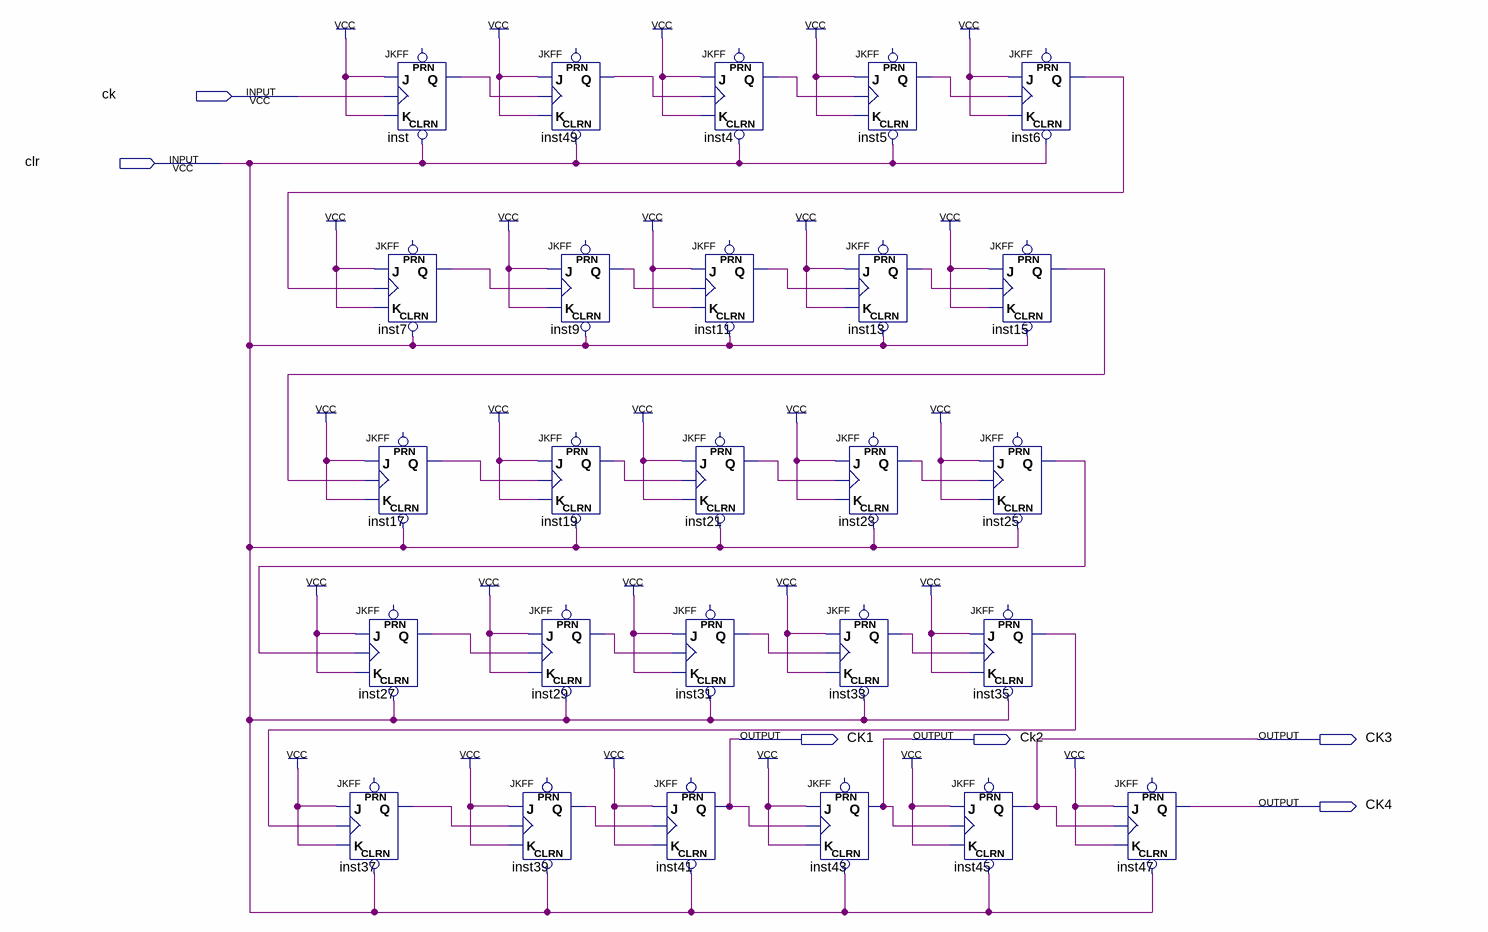
[diagram p0: schematic sheet]
// Quartus schematic ck1.bdf as structural Verilog: 26 symbols, 6 pins
module ck1 (
  input  ck,
  input  clr,
  output CK1,
  output Ck2,
  output CK3,
  output CK4
);

  wire inst4_q, inst5_q, inst6_q, inst7_q, inst9_q, inst11_q, inst13_q, inst15_q, inst17_q, inst19_q,
       inst21_q, inst23_q, inst25_q, inst27_q, inst29_q, inst31_q, inst33_q, inst35_q, inst37_q, inst39_q,
       inst49_q, inst_q;

  JKFF inst17 (.CLRN(clr), .K(1'b1), .J(1'b1), .CLK(inst15_q), .Q(inst17_q));  // open: PRN
  JKFF inst27 (.CLRN(clr), .K(1'b1), .J(1'b1), .CLK(inst25_q), .Q(inst27_q));  // open: PRN
  JKFF inst37 (.CLRN(clr), .K(1'b1), .J(1'b1), .CLK(inst35_q), .Q(inst37_q));  // open: PRN
  JKFF inst (.CLRN(clr), .K(1'b1), .J(1'b1), .CLK(ck), .Q(inst_q));  // open: PRN
  JKFF inst7 (.CLRN(clr), .K(1'b1), .J(1'b1), .CLK(inst6_q), .Q(inst7_q));  // open: PRN
  JKFF inst39 (.CLRN(clr), .K(1'b1), .J(1'b1), .CLK(inst37_q), .Q(inst39_q));  // open: PRN
  JKFF inst49 (.CLRN(clr), .K(1'b1), .J(1'b1), .CLK(inst_q), .Q(inst49_q));  // open: PRN
  JKFF inst9 (.CLRN(clr), .K(1'b1), .J(1'b1), .CLK(inst7_q), .Q(inst9_q));  // open: PRN
  JKFF inst19 (.CLRN(clr), .K(1'b1), .J(1'b1), .CLK(inst17_q), .Q(inst19_q));  // open: PRN
  JKFF inst29 (.CLRN(clr), .K(1'b1), .J(1'b1), .CLK(inst27_q), .Q(inst29_q));  // open: PRN
  JKFF inst31 (.CLRN(clr), .K(1'b1), .J(1'b1), .CLK(inst29_q), .Q(inst31_q));  // open: PRN
  JKFF inst41 (.CLRN(clr), .K(1'b1), .J(1'b1), .CLK(inst39_q), .Q(CK1));  // open: PRN
  JKFF inst4 (.CLRN(clr), .K(1'b1), .J(1'b1), .CLK(inst49_q), .Q(inst4_q));  // open: PRN
  JKFF inst11 (.CLRN(clr), .K(1'b1), .J(1'b1), .CLK(inst9_q), .Q(inst11_q));  // open: PRN
  JKFF inst21 (.CLRN(clr), .K(1'b1), .J(1'b1), .CLK(inst19_q), .Q(inst21_q));  // open: PRN
  JKFF inst33 (.CLRN(clr), .K(1'b1), .J(1'b1), .CLK(inst31_q), .Q(inst33_q));  // open: PRN
  JKFF inst43 (.CLRN(clr), .K(1'b1), .J(1'b1), .CLK(CK1), .Q(Ck2));  // open: PRN
  JKFF inst5 (.CLRN(clr), .K(1'b1), .J(1'b1), .CLK(inst4_q), .Q(inst5_q));  // open: PRN
  JKFF inst13 (.CLRN(clr), .K(1'b1), .J(1'b1), .CLK(inst11_q), .Q(inst13_q));  // open: PRN
  JKFF inst23 (.CLRN(clr), .K(1'b1), .J(1'b1), .CLK(inst21_q), .Q(inst23_q));  // open: PRN
  JKFF inst25 (.CLRN(clr), .K(1'b1), .J(1'b1), .CLK(inst23_q), .Q(inst25_q));  // open: PRN
  JKFF inst35 (.CLRN(clr), .K(1'b1), .J(1'b1), .CLK(inst33_q), .Q(inst35_q));  // open: PRN
  JKFF inst45 (.CLRN(clr), .K(1'b1), .J(1'b1), .CLK(Ck2), .Q(CK3));  // open: PRN
  JKFF inst6 (.CLRN(clr), .K(1'b1), .J(1'b1), .CLK(inst5_q), .Q(inst6_q));  // open: PRN
  JKFF inst15 (.CLRN(clr), .K(1'b1), .J(1'b1), .CLK(inst13_q), .Q(inst15_q));  // open: PRN
  JKFF inst47 (.CLRN(clr), .K(1'b1), .J(1'b1), .CLK(CK3), .Q(CK4));  // open: PRN
endmodule
